# Altium schematic sheet JTAG&Trace.SchDoc
size A4; Revision: B.2(PCB.SCH)
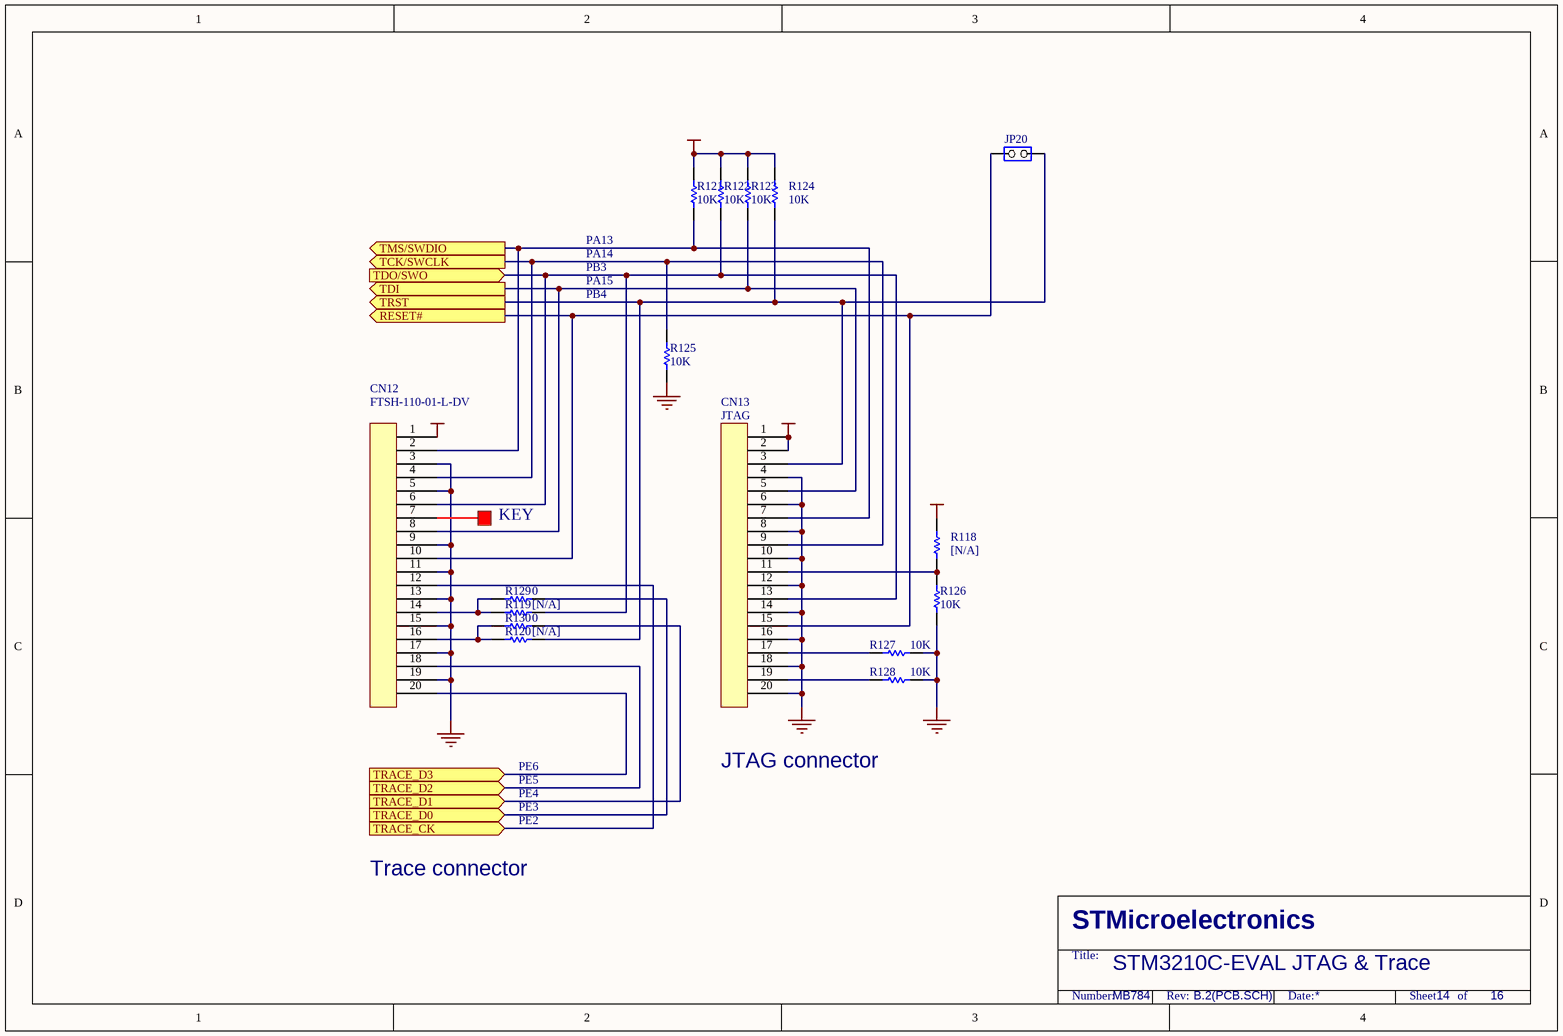
[diagram p0: JTAG&Trace.SchDoc]

## Parts
CN12  FTSH-110-01-L-DV  [FTSH-110-01-L-DV]
CN13  JTAG  [IDC20S]
JP20  (no value)  [SIP2]
R118  [N/A]  [0603R]
R119  [N/A]  [0603R]
R120  [N/A]  [0603R]
R121  10K  [0603R]
R122  10K  [0603R]
R123  10K  [0603R]
R124  10K  [0603R]
R125  10K  [0603R]
R126  10K  [0603R]
R127  10K  [0603R]
R128  10K  [0603R]
R129  0  [0603R]
R130  0  [0603R]

## Ports
RESET# (out), TCK/SWCLK (out), TDI (out), TDO/SWO (in), TMS/SWDIO (out), TRACE_CK (in), TRACE_D0 (in), TRACE_D1 (in), TRACE_D2 (in), TRACE_D3 (in), TRST (out)

## Nets
+3V3: CN12.1 CN13.1 CN13.2 R118.2 R121.2 R122.2 R123.2 R124.2
GND: CN12.3 CN12.5 CN12.9 CN12.11 CN12.13 CN12.15 CN12.17 CN12.19 CN13.4 CN13.6 CN13.8 CN13.10 CN13.12 CN13.14 CN13.16 CN13.18 CN13.20 R125.1 R126.1 R127.2 R128.2
RESET#: CN12.10 CN13.15 JP20.2(NO) ; port RESET#
TCK/SWCLK: CN12.4 CN13.9 R125.2 ; port TCK/SWCLK
TDI: CN12.8 CN13.5 R123.1 ; port TDI
TDO/SWO: CN12.6 CN13.13 R119.2 R122.1 ; port TDO/SWO
TMS/SWDIO: CN12.2 CN13.7 R121.1 ; port TMS/SWDIO
TRACE_CK: CN12.12 ; port TRACE_CK
TRACE_D0: R129.2 ; port TRACE_D0
TRACE_D1: R130.2 ; port TRACE_D1
TRACE_D2: CN12.18 ; port TRACE_D2
TRACE_D3: CN12.20 ; port TRACE_D3
TRST: CN13.3 JP20.1(COMMON) R120.2 R124.1 ; port TRST
NetCN12_14: CN12.14 R119.1 R129.1
NetCN12_16: CN12.16 R120.1 R130.1
NetCN13_11: CN13.11 R118.1 R126.2
NetCN13_17: CN13.17 R127.1
NetCN13_19: CN13.19 R128.1

Not connected (* = marked no-connect by the designer): CN12 7

## Notes on the sheet
- PA13
- PA14
- PB3
- PA15
- PB4
- KEY
- PE6
- PE5
- JTAG connector
- PE4
- PE3
- PE2
- Trace connector
- STM3210C-EVAL JTAG & Trace
- MB784
- 14
- 16
- STMicroelectronics
- Title:
- Number:
- Rev:
- Date:
- Sheet       of

## Library data of the parts
CN12 CN13 = 20PIN1
JP20 = JP2
R118-R130 = Res1: Resistor; Value: 1K; Published: 8-Jun-2000; Revision: July-2002: Re-released for DXP Platform.; Publisher: Altium Limited